# Altium schematic sheet MIKROE262.SchDoc
size A
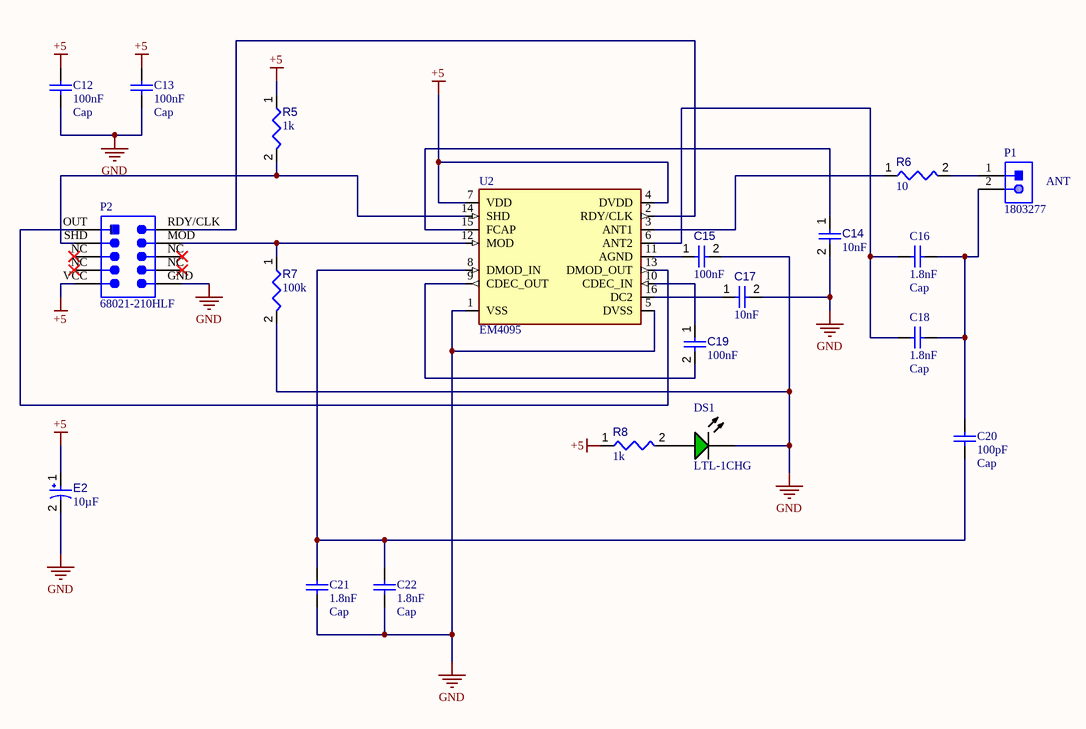
[diagram p0: MIKROE262.SchDoc]

## Parts
C12  Cap  value 100nF  [RAD-0.3]
C13  Cap  value 100nF  [RAD-0.3]
C14  value 10nF  [CAPC0402(1005)60_L]  (hidden comment: Capacitor 10nF +/-20% 50V 0402)
C15  value 100nF  [CAPC0402(1005)60_L]  (hidden comment: Capacitor 100nF +/-20% 25V 0402)
C16  Cap  value 1.8nF  [RAD-0.3]
C17  value 10nF  [CAPC0402(1005)60_L]  (hidden comment: Capacitor 10nF +/-20% 50V 0402)
C18  Cap  value 1.8nF  [RAD-0.3]
C19  value 100nF  [CAPC0402(1005)60_L]  (hidden comment: Capacitor 100nF +/-20% 25V 0402)
C20  Cap  value 100pF  [RAD-0.3]
C21  Cap  value 1.8nF  [RAD-0.3]
C22  Cap  value 1.8nF  [RAD-0.3]
DS1  LTL-1CHG  [LTST-LTL-1CHG-2]
E2  value 10µF  [CAPMP3217X18-T_V]  (hidden comment: TAJA106K016RNJ)
P1  1803277  [PHOE-1803277_V]
P2  68021-210HLF  [FCI-68021-210HLF-10_V]
R5  value 1k  [RESC1005X40X25ML10T10]  (hidden comment: Resistor 1k +/-5% 0402 63 mW)
R6  value 10  [RESC1005X40X25ML10T10]  (hidden comment: Resistor 10R +/-5% 0402 63 mW)
R7  value 100k  [RESC0402(1005)_L]  (hidden comment: Resistor 100K +/-1 % 0402 63 mW)
R8  value 1k  [RESC1005X40X25ML10T10]  (hidden comment: Resistor 1k +/-5% 0402 63 mW)
U2  EM4095  [SO16]

## Nets
+5: C12.2 C13.2 E2.1 P2.VCC R5.1 R8.1 U2.4(DVDD) U2.7(VDD)
GND: C12.1 C13.1 C14.2 C15.2 C17.2 C21.1 C22.1 DS1.2(K) E2.2 P2.GND R7.2 U2.1(VSS) U2.5(DVSS)
NetC14_1: C14.1 U2.15(FCAP)
NetC15_1: C15.1 U2.11(AGND)
NetC16_1: C16.1 C18.1 U2.6(ANT2)
NetC16_2: C16.2 C18.2 C20.2 P1.2
NetC17_1: C17.1 U2.16(DC2)
NetC19_1: C19.1 U2.10(CDEC_IN)
NetC19_2: C19.2 U2.9(CDEC_OUT)
NetC20_1: C20.1 C21.2 C22.2 U2.8(DMOD_IN)
NetDS1_1: DS1.1(A) R8.2
NetP1_1: P1.1 R6.2
NetP2_MOD: P2.MOD R7.1 U2.12(MOD)
NetP2_OUT: P2.OUT(1) U2.13(DMOD_OUT)
NetP2_RDY/CLK: P2.RDY/CLK U2.2(RDY/CLK)
NetP2_SHD: P2.SHD R5.2 U2.14(SHD)
NetR6_1: R6.1 U2.3(ANT1)

Not connected (* = marked no-connect by the designer): P2 NC(5)*

## Notes on the sheet
- (near P1) ANT

## Library data of the parts
C12 C13 C16 C18 C20-C22 = Cap: Capacitor; Published: 8-Jun-2000; LatestRevisionDate: 17-Jul-2002; LatestRevisionNote: Re-released for DXP Platform.; PackageReference: RAD-0.3; Publisher: Altium Limited; PackageDescription: Radial Cap, Thru-Hole; 2 Leads; 0.3 in Pin Spacing
C14 C17 = CMP-001-00069-3: Chip Capacitor, 10nF +/-20%, 50V, 0402, Thickness 0.6 mm; Tolerance: 5%; Max Operating Temperature: 85°C; Pins: 2; Case/Package: 0402; Voltage Rating: 50V; Min Operating Temperature: -55°C; Mounting Technology: SMT
C15 C19 = CMP-001-00065-4: Chip Capacitor, 100nF +/-20%, 25V, 0402, Thickness 0.6 mm; Tolerance: 10%; Max Operating Temperature: 85°C; Min Operating Temperature: -55°C; Pins: 2; Voltage Rating: 25V; Mounting Technology: SMT; Case/Package: 0402
DS1 = CMP-007-00019-2: LED Uni-Color Green, 100 mW, 30 mA, -55 to 100 degC, 2-Pin THD, RoHS, Bulk; Manufacturer: Lite-On; Power: 100mW; Forward Voltage: 2.6V; Forward Current: 30mA; Nominal Vf: 2.1V; Lens Style: Dome; Viewing Angle: 60degrees; Luminous Intensity: 12.6mcd; Max Operating Temperature: 100°C; Case/Package: Radial; Package Reference: LTL-1CHG; Manufacturer URL: http://www.us.liteon.com/; Package Quantity: 1000; Colour: Green; Packaging: Bulk; RoHS Compliant: True; Datasheet URL: http://datasheet.octopart.com/LTL-1CHG-Lite-On-datasheet-143841.pdf; Package Description: 2-Pin Through Hole Device, Dia 3.8 mm; Min Operating Temperature: -55°C; Mounting Technology: TH; Pins: 2; Illumination Colour: Green; Datasheet Version: Mar-00
E2 = CMP-001-00041-7: Standard Tantalum, 10 uF, +/- 10%, 16 V, -55 to 125 degC, 1206 (3216 Metric), RoHS, Tape and Reel; Manufacturer: AVX; Voltage Rating: 16V; ESR: 3Ohm; Datasheet URL: http://datasheets.avx.com/TAJ.pdf; Package URL: http://www.avx.com/download/software/literature/AVX-Footprint-Library.pdf; Pins: 2; Package Reference: CAPMP3217X18-T; RoHS Compliant: True; Case/Package: 1206; Max Operating Temperature: 125°C; Package Description: 2-Pin Surface Mount Device, Body 3.2 x 1.65 mm; Mounting Technology: SM; Tolerance: 10%; Package Quantity: 1; Packaging: TapeandReel; Min Operating Temperature: -55°C; Datasheet Version: Feb-16; Manufacturer URL: http://www.avx.com/; Capacitor Type: Tantalum
P1 = CMP-002-00014-2: Male Header, Pitch 3.81 mm, 1 x 2 Position, Height 7.25 mm, Tail Length 3.4 mm, RoHS, Bulk; Manufacturer: Phoenix Contact; Voltage Rating: 160V; Current Rating: 8A; Rows: 1; Mounting Technology: TH; Contact Plating: Tin; Case/Package: 1803277; Gender: Male; Diameter: 7.25mm; Datasheet Version: Feb-14; Colour: Green; Pins: 2; Lead Pitch: 0.15inch; Connector Type: Header; Package Quantity: 50; Max Current Rating: 8A; Manufacturer URL: http://www.phoenixcontact.com/; Packaging: Bulk; RoHS Compliant: True; Datasheet URL: https://datasheet.ciiva.com/16096/1803277-16096845.pdf; Package Reference: 1803277; Package Description: Male Header, Pitch 3.81 mm, 1 x 2 Position, Height 7.25 mm, Tail Length 3.4 mm
P2 = CMP-002-00020-2: Male Header, Pitch 2.54 mm, 2 x 5 Position, Height 4.83 mm, Tail Length 3.05 mm, Bulk; Manufacturer: FCI Electronics; Datasheet URL: http://portal.fciconnect.com/Comergent//fci/drawing/68020.pdf; Case/Package: 68021-210HLF-10; Manufacturer URL: http://portal.fciconnect.com/; Connector Type: Header; Mounting Technology: TH; Datasheet Version: Rev. BM, 04/2015; Package Description: Male Header, Pitch 2.54 mm, 2 x 5 Position, Height 4.83 mm, Tail Length 3.05 mm; Gender: Male; RoHS Compliant: Unknown; Package Reference: 68021-210HLF-10
R5 R8 = CMP-009-00013-5: Chip Resistor, 1 KOhm, +/- 5%, 0.063 W, -55 to 155 degC, 0402 (1005 Metric); Power: 63mW; Tolerance: 5%; Case/Package: 0402; Mounting Technology: SM; Min Operating Temperature: -55°C; Pins: 2; Max Operating Temperature: 155°C; RoHS Compliant: True
R6 = CMP-009-00020-5: Chip Resistor, 10 Ohm, +/- 5%, 0.063 W, -55 to 155 degC, 0402 (1005 Metric); Power: 63mW; Case/Package: 0402; Max Operating Temperature: 155°C; Min Operating Temperature: -55°C; Pins: 2; Tolerance: 5%; RoHS Compliant: True; Mounting Technology: SM
R7 = CMP-009-00168-3: Chip Resistor, 100 kOhms, +/-1 %, 63 mW, -55 to 155 degC, 0402; Tolerance: 1%; Power: 63mW; Max Operating Temperature: 155°C; Min Operating Temperature: -55°C; Pins: 2; Case/Package: 0402
U2 = EM4095: <b>Read/Write analog front end for 125kHz RFID Basestation</b><p> Source: http://www.emmicroelectronic.com/webfiles/Product/RFID/DS/EM4095_DS.pdf; MF: Others; SnapEDA_Link: https://www.snapeda.com/parts/EM4095/Byte+Brothers/view-part/?ref=snap; Package: None; Value: *; MP: EM4095; Check_prices: https://www.snapeda.com/parts/EM4095/Byte+Brothers/view-part/?ref=eda